# EAGLE design LED (EAGLE 7.1.0)
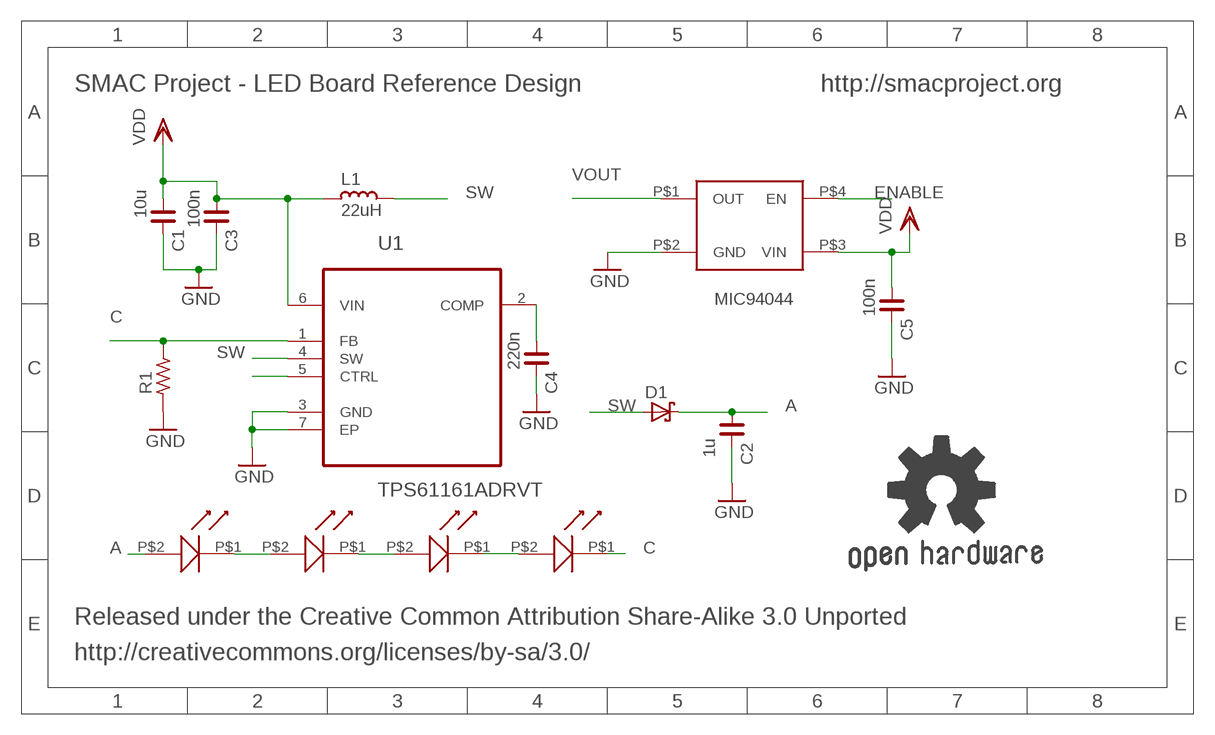
[diagram p0: schematic, sheet 1]

## Parts
C1  10u  C_0402  [C0402]
C2  1u  C_0402  [C0402]
C3  100n  C_0402  [C0402]
C4  220n  C_0402  [C0402]
C5  100n  C_0402  [C0402]
D1  SCHOTTKY-DIODE  [SOD123FL]
GOLD_ORB_SM2  OSHWLOGO_REF_SM  [OSHW2REF]
L1  22uH  L_0805  [L0805]
R1  R_0402  [R0402]
U1  TPS61161ADRVT  [SON65P200X200X80-7N]
U$1  LED_NICHIA  [LED_SMT_NICHIA]
U$2  LED_NICHIA  [LED_SMT_NICHIA]
U$3  LED_NICHIA  [LED_SMT_NICHIA]
U$4  LED_NICHIA  [LED_SMT_NICHIA]
U$5  MIC94044  [MIC94045YFL_FOOTPRINT]

## Nets
A: C2.1 D1.C U$4.P$2(A)
C: R1.2 U1.1(FB) U$2.P$1(K)
CTRL: U1.5(CTRL)
ENABLE: U$5.P$4(EN)
GND: C1.2 C2.2 C3.2 C4.2 C5.2 R1.1 U1.3(GND) U1.7(EP) U$5.P$2(GND)
N$1: U$2.P$2(A) U$3.P$1(K)
N$2: U$1.P$1(K) U$3.P$2(A)
N$3: U$1.P$2(A) U$4.P$1(K)
N$5: C4.1 U1.2(COMP)
SW: D1.A L1.1 U1.4(SW)
VDD: C1.1 C3.1 C5.1 L1.2 U1.6(VIN) U$5.P$3(VIN)
VOUT: U$5.P$1(OUT)

## Notes on the sheet
- SMAC Project - LED Board Reference Design | http://smacproject.org
- Released under the Creative Common Attribution Share-Alike 3.0 Unported
- http://creativecommons.org/licenses/by-sa/3.0/

## Library data of the parts
C1-C5 = rc-master-smd:C_: NON-POLARIZED CAP
D1 = diode:SCHOTTKY-DIODE: Schottky Diode
GOLD_ORB_SM2 = bfl:OSHWLOGO: These are Open-Source Hardware logos.
L1 = rc-master-smd:L_: INDUCTOR
R1 = rc-master-smd:R_: RESISTOR
U1 = TPS61161:TPS61161ADRVT: White LED Driver With PWM; MPN: TPS61161ADRVT; OC_FARNELL: 1735594; OC_NEWARK: 10R0471; PACKAGE: SON-6; SUPPLIER: Texas Instruments
U$1-U$4 = NS2L157AR:LED_NICHIA
U$5 = MIC94045YFL:MIC94044

## Board
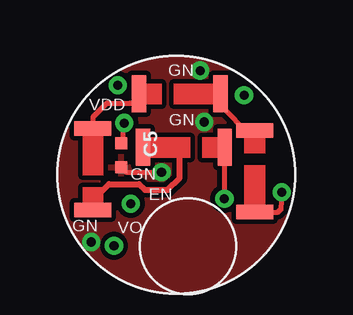
[diagram p1: board, top side]
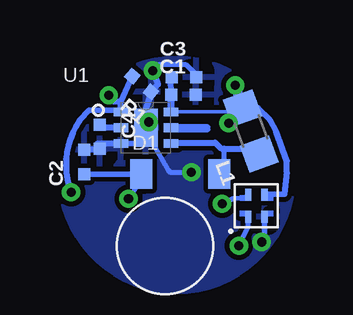
[diagram p2: board, bottom side, seen from below]

No outline drawn. Coordinates in mm, seen from the top.
Copper layers (1*16): Top 0.035mm / dielectric 1.5mm / Bottom 0.035mm
Design rules "2_layer_standard_4pcb *": minimum track width 5mil, minimum drill 15mil, track to track 6mil, track to pad 6mil, pad to pad 6mil, via to via 6mil, smd to smd 0mil, copper to edge 6mil, drill to drill 6mil, minimum pad ring 7.5mil, minimum via ring 7.5mil, stop-mask expansion 1mil, vias tented up to drill 15mil, thermal gap 20mil

### Footprints (pad centres in the part's own frame; a part is rotated, then mirrored left to right if it is on the bottom)
C0402 = smd 0.5 x 0.5: 1 -0.508,0; 2 0.508,0
SOD123FL = smd 0.91 x 1.22: A 1.625,0; C -1.625,0
L0805 = smd 1.2 x 1.3: 1 -1.016,0; 2 1.016,0
R0402 = smd 0.5 x 0.5: 1 -0.508,0; 2 0.508,0
SON65P200X200X80-7N = smd 0.61 x 0.356: 1 -1.041,0.66; 2 -1.041,0; 3 -1.041,-0.66; 4 1.041,-0.66; 5 1.041,0; 6 1.041,0.66 | smd 0.991 x 1.6: 7 0,0
LED_SMT_NICHIA = smd 0.6 x 1.55: P$1 -2.21,0; P$2 1.19,0
MIC94045YFL_FOOTPRINT = smd 0.26 x 0.49: P$1 -0.341,-0.453; P$2 0.342,-0.454; P$3 0.342,0.457; P$4 -0.34,0.454

### Placement (x,y rotation side)
C1  -0.29,3.34 0 bottom
C2  3.84,0.54 90 bottom
C3  -0.31,4.07 0 bottom
C4  3.21,1.59 270 bottom
C5  -2.29,0.82 270 top
D1  -0.16,0.05 0 bottom
GOLD_ORB_SM2  6.66,-3.46 0 top
L1  -3.1,1.83 110 bottom
R1  1.45,3.79 140 bottom
U1  1.27,1.97 0 bottom
U$1  -3.48,-0.27 270 top
U$2  3.27,0.66 90 top
U$3  -0.37,3.38 180 top
U$4  0.82,1.15 0 top
U$5  -3.32,-1.28 0 bottom

### Tracks (layer width: path | path; a pad name or v marks a point on that pad's centre or on a via)
A  (via drill 0.38 pad 0.76)
  Top 0.2: U$4.P$2 2,1.18 2,0.2 v2,-0.99
  Bottom 0.2: D1.C 1.35,0.01 | 1.35,-0.48 1.35,0.01 | 1.35,0.01 v2,-0.99
  Bottom 0.25: C2.1 3.83,0.02 D1.C
C  (via drill 0.38 pad 0.76)
  Top 0.2: v4.39,-0.72 4.35,-1.43 4.23,-1.55 U$2.P$1
  Bottom 0.25: 2.31,3.05 U1.1 2.37,2.68 3.64,2.69 4.05,2.25 arc-55 v4.39,-0.72 | 2.31,3.05 R1.2 | 2.31,3.05 2.62,3.05 v2.82,3.32
CTRL
  Bottom 0.2: 0.05,2 0.04,2 -1.3,2 -1.3,1.89 0.06,1.89 0.14,1.97 U1.5
ENABLE  (via drill 0.38 pad 0.76)
  Bottom 0.2: U$5.P$4 -2.83,-0.98 -2.36,-0.98 v-1.9,-1.2
GND  (via drill 0.38 pad 0.76)
  Top 0.2: C5.2 -2.1,0.12 v-0.62,0.11
  Bottom 0.2: 1.27,1.46 U1.7 | 1.27,1.46 1.43,1.31 U1.3 | 1.27,1.46 1.04,1.38 0.34,0.2 0.27,0.12 v-0.62,0.11 | v-3.55,-2.79 -3.67,-2.65 U$5.P$2 | C3.2 -0.82,4.18 -0.4,4.59 0.75,4.59 v0.99,4.35
  Bottom 0.25: U1.3 3.29,1.31 C4.2 3.21,1.05 C2.2 | R1.1 1.47,2.17 U1.7 1.16,2.08 v1.16,2.21 | R1.1 arc-90 0.96,3.57 1.01,3.5 | v0.99,4.35 0.78,3.78 R1.1
  pour Top (isolate 0.2): -4.9,0 arc90 0,-4.9 arc90 4.9,0 arc90 0,4.9 arc90
  pour Bottom (isolate 0.2): -4.9,0 arc90 0,-4.9 arc90 4.9,0 arc90 0,4.9 arc90
N$1
  Top 0.2: U$3.P$1 2.03,3.19 2.03,2.7 2.88,1.85 U$2.P$2
N$2
  Top 0.2: U$1.P$1 -3.48,2.41 -2.9,2.99 -1.94,2.99 arc90 U$3.P$2
N$3
  Top 0.2: U$4.P$1 -0.6,1.18 -0.06,1.13 0.14,0.93
  Top 0.25: U$1.P$2 -3.54,-1.12 -2.8,-0.38 -1.56,-0.38 -1.32,-0.63 -0.35,-0.63 0.14,-0.13 0.14,0.93
N$5
  Bottom 0.25: 2.34,1.94 2.42,2.02 2.42,1.97 U1.2 3.3,1.97 C4.1
SW
  Bottom 0.2: -1.98,1.09 -1.98,0.22 D1.A
  Bottom 0.25: -3.41,1.06 L1.1 -3.29,1.09 -1.98,1.09 -1.86,1.09 -1.61,1.35 0.23,1.35 U1.4
VDD  (via drill 0.38 pad 0.76)
  Top 0.2: C5.1 -2.16,1.35 -2.23,1.42 v-2.17,2.16
  Bottom 0.15: L1.2 -2.59,2.63 U1.6
  Bottom 0.2: v-2.17,2.16 L1.2
  Bottom 0.25: U1.6 | -2.45,3.72 v-2.44,3.73 | C1.1 0.24,4.04 C3.1 | L1.2 -3.39,2.79 -3.88,2.3 -4.15,1.8 -4.6,0.58 -4.59,0.14 -4.5,-0.8 U$5.P$3
  Bottom 0.3: C1.1 0.23,3.32 U1.6
  Bottom 0.406: -2.45,3.72 L1.2
VOUT  (via drill 0.38 pad 0.76)
  Bottom 0.2: U$5.P$1 -2.97,-2.18 v-2.6,-2.95

### Text on the board
tPlace: GN | VDD | GN | GN | EN | GN | VO
Reference: http://smacproject.org